# Altium schematic sheet Sheet2.SchDoc
size B; Author: E. Sims; Organization: Let's Build Rockets Inc.; SheetNumber: 2; SheetTotal: 3
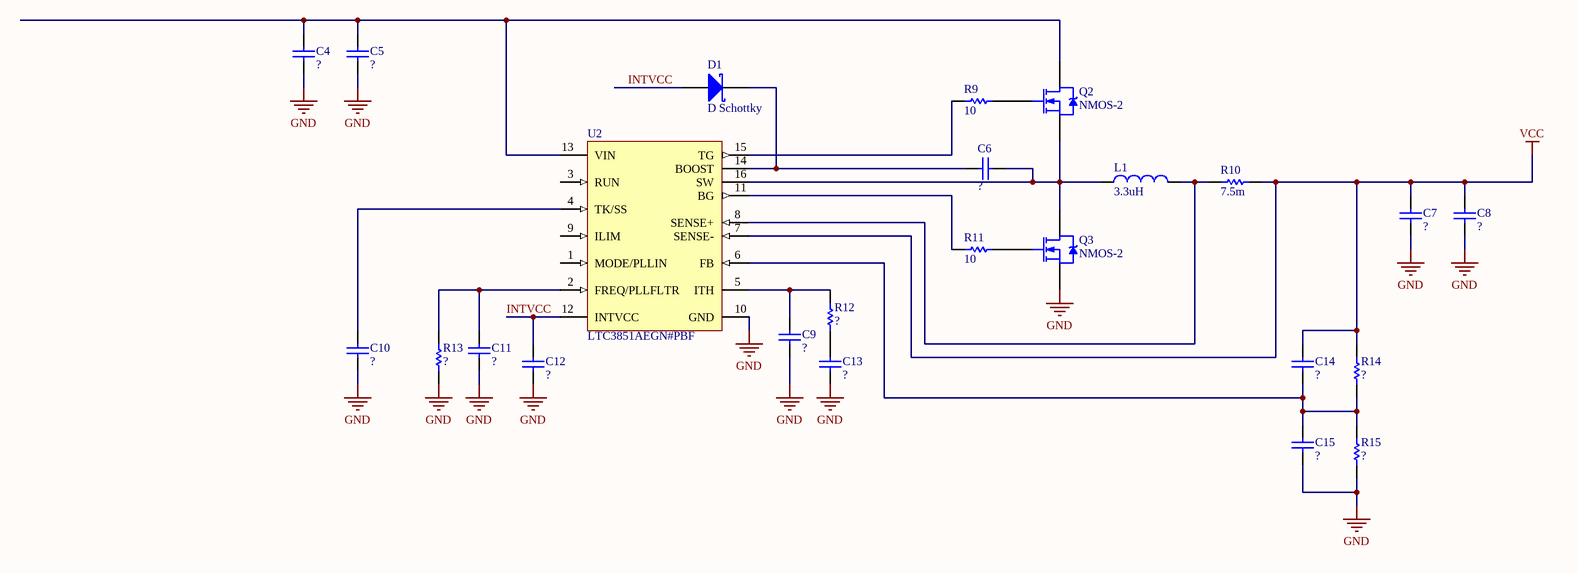
[diagram p0: Sheet2.SchDoc]

## Parts
C4  Cap  [RAD-0.3]  (value not drawn)
C5  Cap  [RAD-0.3]  (value not drawn)
C6  Cap  [RAD-0.3]  (value not drawn)
C7  Cap  [RAD-0.3]  (value not drawn)
C8  Cap  [RAD-0.3]  (value not drawn)
C9  Cap  [RAD-0.3]  (value not drawn)
C10  Cap  [RAD-0.3]  (value not drawn)
C11  Cap  [RAD-0.3]  (value not drawn)
C12  Cap  [RAD-0.3]  (value not drawn)
C13  Cap  [RAD-0.3]  (value not drawn)
C14  Cap  [RAD-0.3]  (value not drawn)
C15  Cap  [RAD-0.3]  (value not drawn)
D1  D Schottky  [SMB]
L1  value 3.3uH  [0402-A]  (hidden comment: Inductor)
Q2  NMOS-2  [TO-220AB]
Q3  NMOS-2  [TO-220AB]
R9  value 10  [AXIAL-0.3]  (hidden comment: Res1)
R10  value 7.5m  [AXIAL-0.3]  (hidden comment: Res1)
R11  value 10  [AXIAL-0.3]  (hidden comment: Res1)
R12  Res1  [AXIAL-0.3]  (value not drawn)
R13  Res1  [AXIAL-0.3]  (value not drawn)
R14  Res1  [AXIAL-0.3]  (value not drawn)
R15  Res1  [AXIAL-0.3]  (value not drawn)
U2  LTC3851AEGN#PBF  [LT-GN-16_L]

## Nets
GND: C4.1 C5.1 C7.1 C8.1 C9.1 C10.1 C11.1 C12.1 C13.1 C15.1 Q3.3(S) R13.1 R15.1 U2.10(GND)
VCC: C7.2 C8.2 C14.2 R10.1 R14.2 U2.7(SENSE-)
INTVCC: C12.2 D1.1(A) U2.12(INTVCC)
NetC4_2: C4.2 C5.2 Q2.2(D) U2.13(VIN)
NetC6_1: C6.1 L1.1 Q2.3(S) Q3.2(D) U2.16(SW)
NetC6_2: C6.2 D1.2(K) U2.14(BOOST)
NetC9_2: C9.2 R12.2 U2.5(ITH)
NetC10_2: C10.2 U2.4(TK/SS)
NetC11_2: C11.2 R13.2 U2.2(FREQ/PLLFLTR)
NetC13_2: C13.2 R12.1
NetC14_1: C14.1 C15.2 R14.1 R15.2 U2.6(FB)
NetL1_2: L1.2 R10.2 U2.8(SENSE+)
NetQ2_1: Q2.1(G) R9.1
NetQ3_1: Q3.1(G) R11.1
NetR9_2: R9.2 U2.15(TG)
NetR11_2: R11.2 U2.11(BG)

Not connected (* = marked no-connect by the designer): U2 1(MODE/PLLIN) 3(RUN) 9(ILIM)

## Notes on the sheet
- Let's Build Rocket's Inc. Modular Paylaod System Based on TMP-010 Rev
  For more information visit https://github.com/LetsBuildRockets/Modular-Payload-System
  This work is licensed under CC BY-NC 4.0. To view a copy of this license, visit https://creativecommons.org/licenses/by-nc/4.0
- Title
- Size:
- Date:
- Assembly Variant:
- B
- Number:
- Time:
- Revision:
- Sheet
- of
- Author:
- File:

## Library data of the parts
C4-C15 = Cap: Capacitor; Published: 8-Jun-2000; LatestRevisionDate: 17-Jul-2002; LatestRevisionNote: Re-released for DXP Platform.; PackageReference: RAD-0.3; Publisher: Altium Limited; PackageDescription: Radial Cap, Thru-Hole; 2 Leads; 0.3 in Pin Spacing; Value: ?
D1 = D Schottky: Schottky Diode; Published: 8-Jun-2000; LatestRevisionDate: 17-Jul-2002; LatestRevisionNote: Re-released for DXP Platform.; PackageReference: SMB; Publisher: Altium Limited; PackageDescription: DO-214-AA/SMB; 2 C-Bend Leads; Body 5.3 x 3.6 mm, inc. leads (LxW); Code_JEDEC: DO-214-AA
L1 = Inductor: Code_IEC: 1005; Published: 8-Jun-2000; LatestRevisionDate: 29-May-2009; LatestRevisionNote: IPC-7351 Footprint Added.; PackageReference: 0402-A; Publisher: Altium Limited; PackageDescription: Chip Inductor; Code_JEITA: 0402
Q2 Q3 = NMOS-2: N-Channel Power MOSFET; Note: Pin 2 is electrically connected to pin 4.; Published: 8-Jun-2000; LatestRevisionDate: 17-Jul-2002; LatestRevisionNote: Re-released for DXP Platform.; DatasheetVersion: PD-9.814; PackageVersion: Feb-1997; PackageReference: TO-220AB; Publisher: Altium Limited; PackageDescription: TO, Thru-Hole, Vertical, Heatsink Mounted; 3 In-Line Leads; Pitch 2.54 mm; ComponentLink1Description: Manufacturer Link; ComponentLink1URL: http://www.irf.com/
R9-R15 = Res1: Resistor; Published: 8-Jun-2000; LatestRevisionDate: 17-Jul-2002; LatestRevisionNote: Re-released for DXP Platform.; PackageReference: AXIAL-0.3; Publisher: Altium Limited; PackageDescription: Axial Device, Thru-Hole; 2 Leads; 0.3 in Pin Spacing
  R12-R15: Value: ?
U2 = CMP-0492-01020-1: Synchronous Step-Down Switching Regulator Controller (with Improved PLL), 16-pin SOP (GN-16), -40 to 125 degC, Pb-Free; Manufacturer: Linear Technology; Number of Outputs: 1; Frequency Sync Range: 250kHz - 750kHz; ComponentLink3URL: http://cds.linear.com/docs/en/packaging/05081641_B_GN16.pdf; ComponentLink2URL: http://cds.linear.com/docs/en/datasheet/3851afa.pdf; PartNumber: LTC3851AEGN#PBF; Mounting Technology: Surface Mount; PackageDescription: 16-Pin Plastic SSOP, Body 4.9 x 3.9 mm, Pitch 0.635 mm; ComponentLink1URL: http://www.linear.com/; ComponentLink1Description: Manufacturer URL; ComponentLink2Description: Datasheet; RoHS: TRUE; PackageReference: GN-16; DatasheetVersion: Rev. A; PackageVersion: Rev. B, 03/2012; ComponentLink3Description: Package Specification